# EAGLE schematic PiezoEagle (EAGLE 7.5.0)
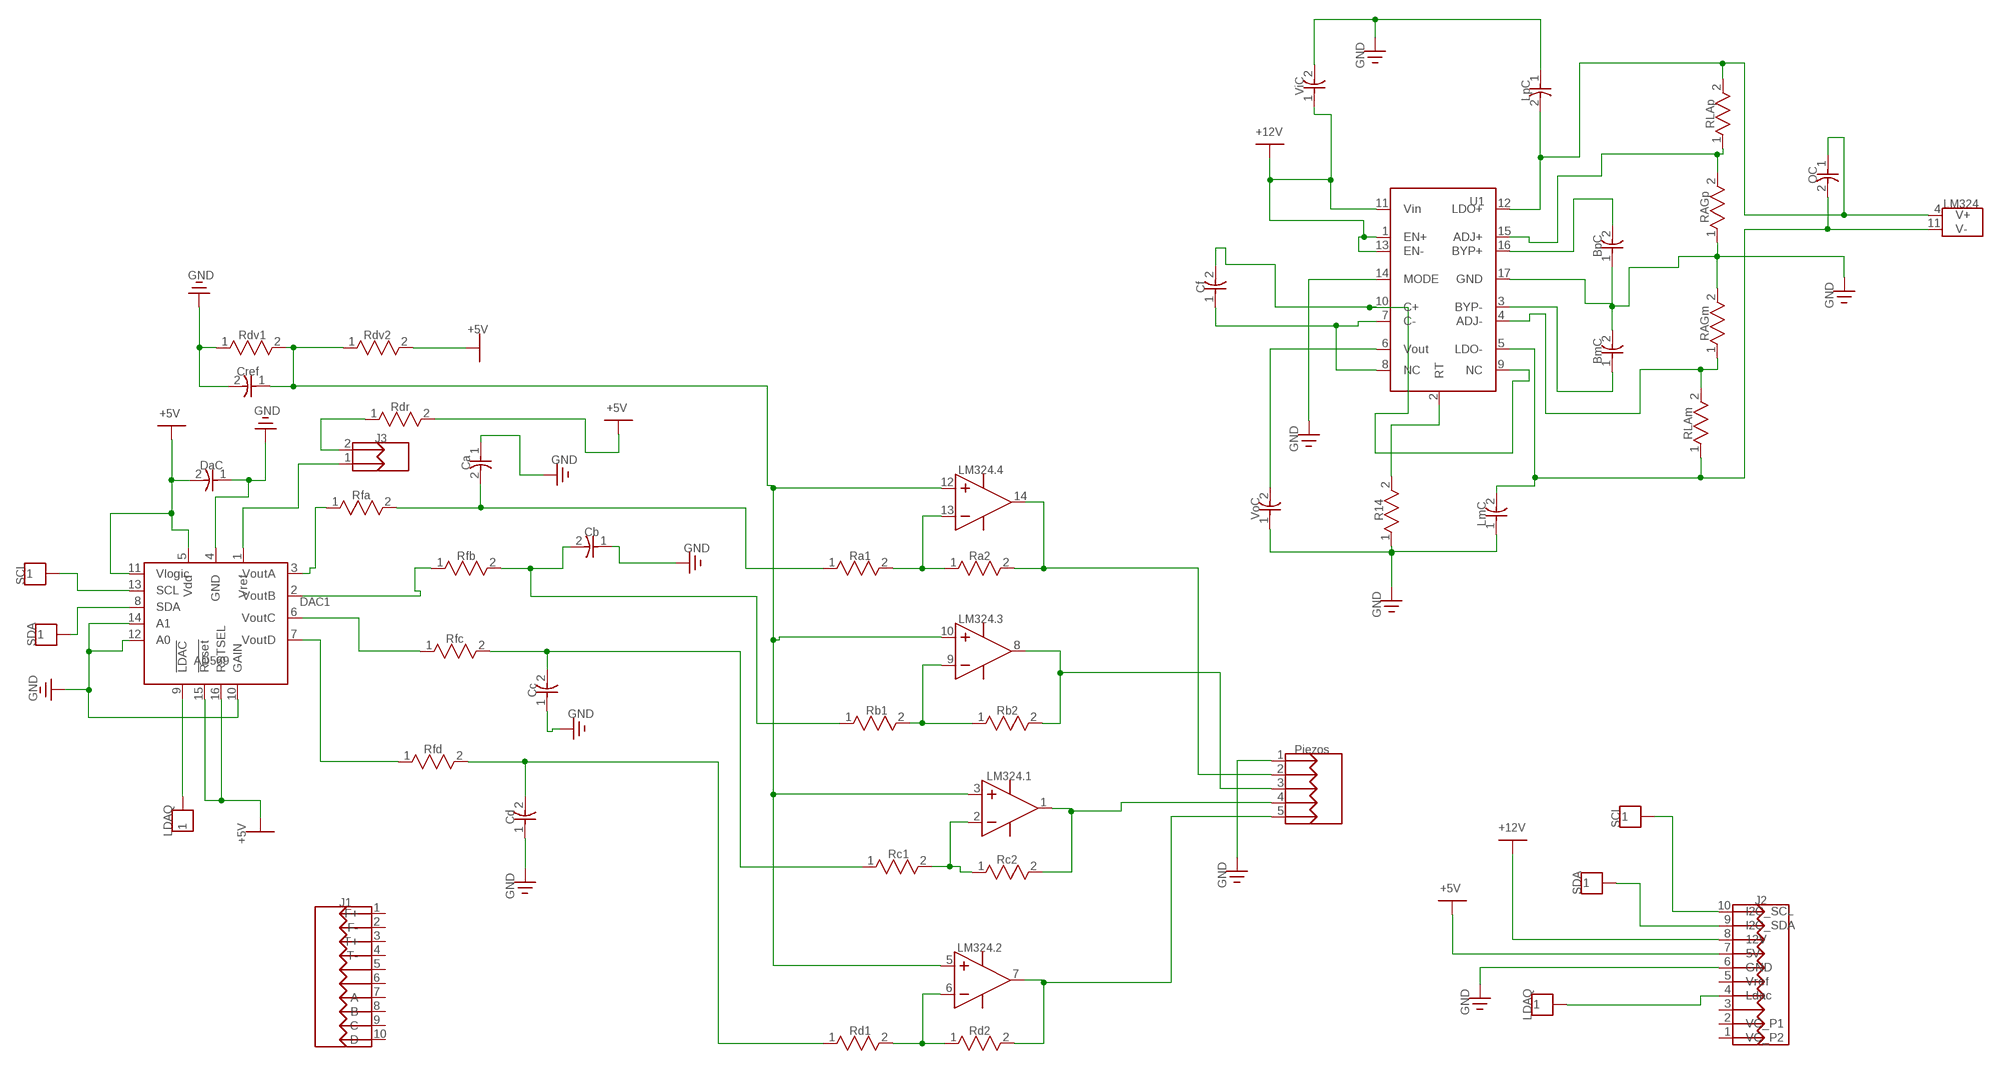
[diagram p0: schematic, sheet 1]

## Parts
BmC  10nF  CAP_0805  [CAP_0805]
BpC  10nF  CAP_0805  [CAP_0805]
Ca  3.2uF  CAP_0805  [CAP_0805]
Cb  3.2uF  CAP_0805  [CAP_0805]
Cc  3.2uF  CAP_0805  [CAP_0805]
Cd  3.2uF  CAP_0805  [CAP_0805]
Cf  1uF  CAP_0805  [CAP_0805]
Cref  3.2uF  CAP_0805  [CAP_0805]
DaC  3.2uF  CAP_0805  [CAP_0805]
DAC1  AD5696RARUZ  [AD5696RARUZ]
J1  1-644456-0  [HDR-1X10T/2.54/25X2]
J2  1-644456-0_3  [HDR-1X10T/2.54/25X2]
J3  90131-0121  [HDR-2X1T/2.54X2.54/3X5]
LM324  LM324AD  [SOIC-14/150MIL]
LmC  10uF  CAP_0805  [CAP_0805]
LpC  10uF  CAP_0805  [CAP_0805]
OC  10uF  CAP_0805  [CAP_0805]
Piezos  CON5M  [HDR-1X5T/2.54/12X2]
R14  200k  RES_0402  [RES_0402]
Ra1  5k  RES_0805  [RES_0805]
Ra2  30k  RES_0805  [RES_0805]
RAGm  100k  RES_0805  [RES_0805]
RAGp  100k  RES_0805  [RES_0805]
Rb1  5k  RES_0805  [RES_0805]
Rb2  30k  RES_0805  [RES_0805]
Rc1  5k  RES_0805  [RES_0805]
Rc2  30k  RES_0805  [RES_0805]
Rd1  5k  RES_0805  [RES_0805]
Rd2  30k  RES_0805  [RES_0805]
Rdr  10k  RES_0805  [RES_0805]
Rdv1  10k  RES_0805  [RES_0805]
Rdv2  10k  RES_0805  [RES_0805]
Rfa  5k  RES_0805  [RES_0805]
Rfb  5k  RES_0805  [RES_0805]
Rfc  5k  RES_0805  [RES_0805]
Rfd  5k  RES_0805  [RES_0805]
RLAm  800k  RES_0805  [RES_0805]
RLAp  800k  RES_0805  [RES_0805]
U1  LTC3260  [LTC3260_MSOP]
ViC  10uF  CAP_0805  [CAP_0805]
VoC  10uF  CAP_0805  [CAP_0805]

## Nets
5V: DAC1.5(Vdd) DAC1.11(Vlogic) DAC1.15(!Reset) DAC1.16(RSTSEL) DaC.2 J2.7(5V) Rdr.2 Rdv2.2 ; supply symbol labelled +5V
Gnd: BmC.2 BpC.1 Ca.1 Cb.1 Cc.1 Cd.1 Cref.2 DAC1.4(GND) DAC1.10(GAIN) DAC1.12(A0) DAC1.14(A1) DaC.1 J2.6(GND) LmC.1 LpC.1 Piezos.1 R14.1 RAGm.2 RAGp.1 Rdv1.1 U1.14(MODE) U1.17(GND) ViC.2 VoC.1 ; supply symbol labelled GND
Net_0: LM324.13(PART_4:IN-) Ra1.2 Ra2.1
Net_1: LM324.4(VCC_AND_GND:V+) LpC.2 OC.1 RLAp.2 U1.12(LDO+)
Net_2: Cref.1 LM324.3(PART_1:IN+) LM324.5(PART_2:IN+) LM324.10(PART_3:IN+) LM324.12(PART_4:IN+) Rdv1.2 Rdv2.1
Net_3: DAC1.3(VoutA) Rfa.1
Net_4: Ca.2 Ra1.1 Rfa.2
Net_5: LM324.9(PART_3:IN-) Rb1.2 Rb2.1
Net_6: LM324.8(PART_3:OUT) Piezos.3 Rb2.2
Net_7: Cd.2 Rd1.1 Rfd.2
Net_8: LM324.2(PART_1:IN-) Rc1.2 Rc2.1
Net_9: LM324.1(PART_1:OUT) Piezos.4 Rc2.2
Net_10: DAC1.6(VoutC) Rfc.1
Net_11: LM324.6(PART_2:IN-) Rd1.2 Rd2.1
Net_12: Cc.2 Rc1.1 Rfc.2
Net_13: DAC1.13(SCL) J2.10(I2C_SCL) ; supply symbol labelled SCL
Net_14: DAC1.8(SDA) J2.9(I2C_SDA) ; supply symbol labelled SDA
Net_15: DAC1.9(!LDAC) J2.4(Ldac) ; supply symbol labelled LDAQ, LDAQ_15
Net_16: Cb.2 Rb1.1 Rfb.2
Net_17: Cf.1 U1.7(C-) U1.8(NC)
Net_18: Cf.2 U1.9(NC) U1.10(C+)
Net_19: LM324.14(PART_4:OUT) Piezos.2 Ra2.2
Net_20: J2.8(12V) U1.1(EN+) U1.11(Vin) U1.13(EN-) ViC.1 ; supply symbol labelled +12V
Net_21: LM324.11(VCC_AND_GND:V-) LmC.2 OC.2 RLAm.1 U1.5(LDO-)
Net_22: U1.6(Vout) VoC.2
Net_23: R14.2 U1.2(RT)
Net_24: BpC.2 U1.16(BYP+)
Net_25: DAC1.2(VoutB) Rfb.1
Net_26: BmC.1 U1.3(BYP-)
Net_28: RAGp.2 RLAp.1 U1.15(ADJ+)
Net_30: RAGm.1 RLAm.2 U1.4(ADJ-)
Net_31: LM324.7(PART_2:OUT) Piezos.5 Rd2.2
Net_32: DAC1.7(VoutD) Rfd.1
Net_33: J3.2 Rdr.1
Net_34: DAC1.1(Vref) J3.1
Unconnected: J1.1(F+) J1.2(F-) J1.3(T+) J1.4(T-) J1.5 J1.6 J1.7(A) J1.8(B) J1.9(C) J1.10(D) J2.1(VC_P2) J2.2(VC_P1) J2.3 J2.5(Vref)

## Notes on the sheet
- GND
- ViC
- LpC
- RLAp
- +12V
- OC
- U1 | LM324
- RAGp
- BpC
- GND
- Cf
- GND
- +5V
- Rdv1 | Rdv2 | RAGm
- BmC
- Cref
- Rdr | +5V
- +5V | GND
- J3 | RLAm
- GND
- GND
- DaC | Ca
- LM324.4
- Rfa
- VoC | R14
- LmC
- Cb
- GND
- Rfb | Ra1 | Ra2
- SCL
- DAC1
- GND
- LM324.3
- SDA | Rfc
- AD569
- Cc
- GND
- Rb1 | Rb2
- GND
- Rfd | Piezos
- LM324.1
- Cd
- SCL
- +12V
- LDAQ
- +5V
- Rc1
- Rc2
- GND
- +5V | SDA
- GND
- J1 | J2
- LM324.2
- GND
- LDAQ
- Rd1 | Rd2

## Library data of the parts
BmC BpC = common:CAP_0805; DATASHEET: http://uk.rs-online.com/web/p/ceramic-multilayer-capacitors/2644371/
Ca Cb Cc Cd Cf Cref DaC LmC LpC OC ViC VoC = common:CAP_0805; DATASHEET: http://uk.rs-online.com/web/p/ceramic-multilayer-capacitors/2644371/; VALUE: 10nF
DAC1 = common:AD5696RARUZ; DATASHEET: http://docs-europe.electrocomponents.com/webdocs/12f9/0900766b812f9ce4.pdf
J1 = common:1-644456-0; DATASHEET: http://datasheets.diptrace.com\con_headers\ENG_CD_644456_D2.pdf; MANUFACTURER: TE Connectivity
J2 = common:1-644456-0_3; DATASHEET: http://datasheets.diptrace.com\con_headers\ENG_CD_644456_D2.pdf; MANUFACTURER: TE Connectivity
J3 = common:90131-0121; DATASHEET: http://datasheets.diptrace.com\con_headers\901310126_sd.pdf; MANUFACTURER: Molex
LM324 = common:LM324AD; DATASHEET: http://datasheets.diptrace.com/motorola/LM224_324_2902.pdf; MANUFACTURER: Motorola
Piezos = common:CON5M
R14 = common:RES_0402; DATASHEET: http://uk.rs-online.com/web/p/surface-mount-fixed-resistors/3714998/
Ra1 Rb1 Rc1 Rd1 Rfa Rfb Rfc Rfd = common:RES_0805
Ra2 RAGm RAGp Rb2 Rc2 Rd2 Rdr Rdv1 Rdv2 RLAm RLAp = common:RES_0805; VALUE: 5k
U1 = common:LTC3260